# Altium schematic sheet power.SchDoc: sadasd
size A4
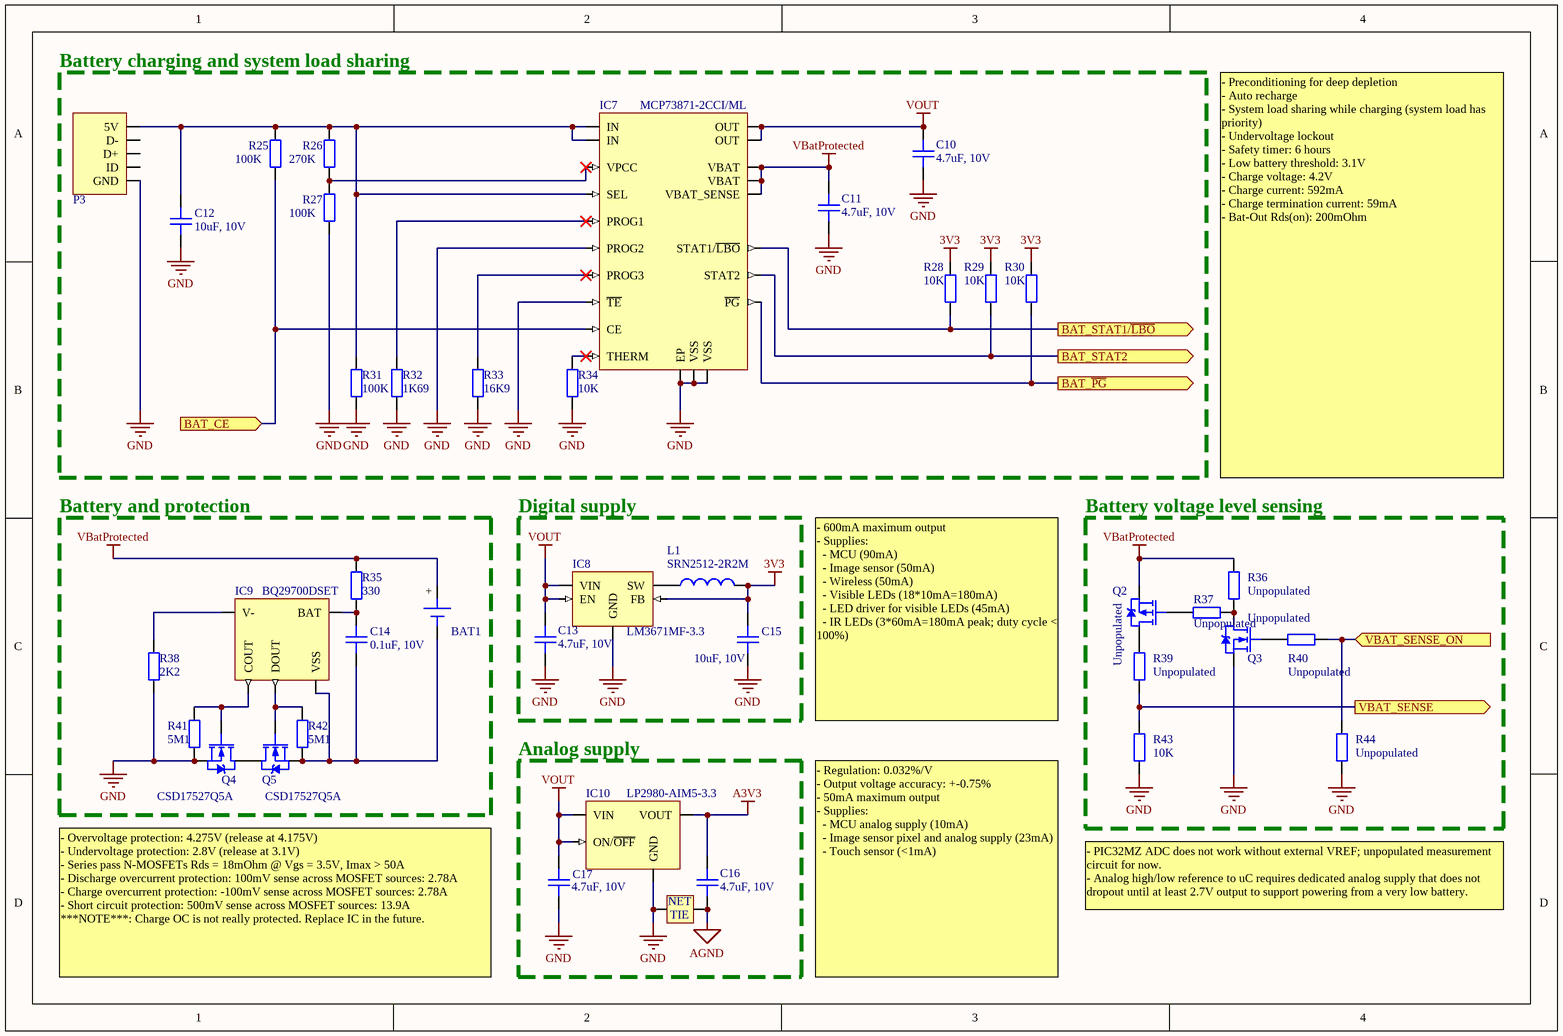
[diagram p0: power.SchDoc]

## Parts
BAT1  Battery_1S  [WAGO 2059-302]  (value not drawn)
C10  4.7uF, 10V  [1608[0603]_M]
C11  4.7uF, 10V  [1608[0603]_M]
C12  10uF, 10V  [1608[0603]_M]
C13  4.7uF, 10V  [1608[0603]_M]
C14  0.1uF, 10V  [1608[0603]_M]
C15  10uF, 10V  [1608[0603]_M]
C16  4.7uF, 10V  [1608[0603]_M]
C17  4.7uF, 10V  [1608[0603]_M]
IC7  MCP73871-2CCI/ML  [QFN-20_M]
IC8  LM3671MF-3.3  [SOT23-5_N]
IC9  BQ29700DSET  [WSON-6_M]
IC10  LP2980-AIM5-3.3  [SOT23-5_N]
L1  SRN2512-2R2M  [2520[1008]_N]
NT1  NET-TIE  [NET-TIE-0.15MM]  (value not drawn)  (net tie, no BOM)
P3  MicroUSB2.0  [USB3076_M]  (value not drawn)
Q2  Unpopulated  [SOT23-3_N]
Q3  Unpopulated  [SOT23-3_N]
Q4  CSD17527Q5A  [PG-TDSON-8_MOSFET_M]
Q5  CSD17527Q5A  [PG-TDSON-8_MOSFET_M]
R25  100K  [1608[0603]_M]
R26  270K  [1608[0603]_M]
R27  100K  [1608[0603]_M]
R28  10K  [1608[0603]_M]
R29  10K  [1608[0603]_M]
R30  10K  [1608[0603]_M]
R31  100K  [1608[0603]_M]
R32  1K69  [1608[0603]_M]
R33  16K9  [1608[0603]_M]
R34  10K  [1608[0603]_M]
R35  330  [1608[0603]_M]
R36  Unpopulated  [1608[0603]_M]
R37  Unpopulated  [1608[0603]_M]
R38  2K2  [1608[0603]_M]
R39  Unpopulated  [1608[0603]_M]
R40  Unpopulated  [1608[0603]_M]
R41  5M1  [1608[0603]_M]
R42  5M1  [1608[0603]_M]
R43  10K  [1608[0603]_M]
R44  Unpopulated  [1608[0603]_M]

## Blocks framed on the sheet
Battery charging and system load sharing: C10-C12 IC7 P3 R25-R34
Battery and protection: BAT1 C14 IC9 Q4 Q5 R35 R38 R41 R42
Digital supply: C13 C15 IC8 L1
Battery voltage level sensing: Q2 Q3 R36 R37 R39 R40 R43 R44
Analog supply: C16 C17 IC10 NT1

## Ports
BAT_CE (in), BAT_STAT1/~{LBO} (out), BAT_STAT2 (out), BAT_~{PG} (out), VBAT_SENSE (out), VBAT_SENSE_ON (in)

## Nets
3V3: C15.2 IC8.4(FB) L1.2 R28.2 R29.2 R30.2
A3V3: C16.2 IC10.5(VOUT)
AGND: C16.1 NT1.2
GND: C10.1 C11.1 C12.1 C13.1 C15.1 C17.1 IC7.4(PROG2) IC7.9(~{TE}) IC7.10(VSS) IC7.11(VSS) IC7.EP IC8.2(GND) IC10.2(GND) NT1.1 P3.5(GND) Q3.S Q4.S R27.1 R31.1 R32.1 R33.1 R34.1 R38.1 R41.1 R43.1 R44.1
VBatProtected: BAT1.+ C11.2 IC7.14(VBAT) IC7.15(VBAT) IC7.16(VBAT_SENSE) Q2.S R35.2 R36.2
VOUT: C10.2 C13.2 C17.2 IC7.1(OUT) IC7.20(OUT) IC8.1(VIN) IC8.3(EN) IC10.1(VIN) IC10.3(ON/~{OFF})
BAT_CE: IC7.17(CE) R25.1 ; port BAT_CE
BAT_~{PG}: IC7.6(~{PG}) R30.1 ; port BAT_~{PG}
BAT_STAT1/~{LBO}: IC7.8(STAT1/~{LBO}) R28.1 ; port BAT_STAT1/~{LBO}
BAT_STAT2: IC7.7(STAT2) R29.1 ; port BAT_STAT2
VBAT_SENSE: R39.1 R43.2 ; port VBAT_SENSE
VBAT_SENSE_ON: R40.2 R44.2 ; port VBAT_SENSE_ON
NetBAT1_-: BAT1.- C14.1 IC9.4(VSS) Q5.S R42.1
NetC12_2: C12.2 IC7.3(SEL) IC7.18(IN) IC7.19(IN) P3.1(5V) R25.2 R26.2 R31.2
NetC14_2: C14.2 IC9.5(BAT) R35.1
NetIC7_2: IC7.2(VPCC) R26.1 R27.2
NetIC7_5: IC7.5(THERM) R34.2
NetIC7_12: IC7.12(PROG3) R33.2
NetIC7_13: IC7.13(PROG1) R32.2
NetIC8_5: IC8.5(SW) L1.1
NetIC9_2: IC9.2(COUT) Q4.G R41.2
NetIC9_3: IC9.3(DOUT) Q5.G R42.2
NetIC9_6: IC9.6(V-) R38.2
NetQ2_D: Q2.D R39.2
NetQ2_G: Q2.G R37.1
NetQ3_D: Q3.D R36.1 R37.2
NetQ3_G: Q3.G R40.1
NetQ4_D: Q4.D Q5.D

Not connected (* = marked no-connect by the designer): P3 2(D-) 3(D+) 4(ID)

## Notes on the sheet
- - Preconditioning for deep depletion
  - Auto recharge
  - System load sharing while charging (system load has priority)
  - Undervoltage lockout
  - Safety timer: 6 hours
  - Low battery threshold: 3.1V
  - Charge voltage: 4.2V
  - Charge current: 592mA
  - Charge termination current: 59mA
  - Bat-Out Rds(on): 200mOhm
- - 600mA maximum output
  - Supplies:
  - MCU (90mA)
  - Image sensor (50mA)
  - Wireless (50mA)
  - Visible LEDs (18*10mA=180mA)
  - LED driver for visible LEDs (45mA)
  - IR LEDs (3*60mA=180mA peak; duty cycle < 100%)
- - PIC32MZ ADC does not work without external VREF; unpopulated measurement circuit for now.
  - Analog high/low reference to uC requires dedicated analog supply that does not dropout until at least 2.7V output to support powering from a very low battery.
- - Overvoltage protection: 4.275V (release at 4.175V)
  - Undervoltage protection: 2.8V (release at 3.1V)
  - Series pass N-MOSFETs Rds = 18mOhm @ Vgs = 3.5V, Imax > 50A
  - Discharge overcurrent protection: 100mV sense across MOSFET sources: 2.78A
  - Charge overcurrent protection: -100mV sense across MOSFET sources: 2.78A
  - Short circuit protection: 500mV sense across MOSFET sources: 13.9A
  ***NOTE***: Charge OC is not really protected. Replace IC in the future.
- - Regulation: 0.032%/V
  - Output voltage accuracy: +-0.75%
  - 50mA maximum output
  - Supplies:
  - MCU analog supply (10mA)
  - Image sensor pixel and analog supply (23mA)
  - Touch sensor (<1mA)
- (in symbol NET-TIE) NET; TIE

## Library data of the parts
BAT1 = Battery_1S: Generic single cell battery; pin to pad: +>1 ->2
C10-C17 = Capacitor: Generic Capacitor
  C10 C11 C13 C16 C17: Value: 4.7uF, 10V
  C12 C15: Value: 10uF, 10V
  C14: Value: 0.1uF, 10V
IC7 = MCP73871-2CCI/ML: Li-Po battery charge controller with system load sharing
IC8 = LM3671: 2MHz, 600mA step-down converter
IC9 = BQ29700: Li-Po battery voltage and current protection
IC10 = LP2980-N: 50 mA, ultra low drop-out voltage regulator
L1 = Inductor: Value: 2.2uH
NT1 = NET-TIE: Generic net tie
P3 = MicroUSB2.0: Micro USB 2.0 plug/receptacle, 5-Leads
Q2 = MOSFET-P_BodyDiode: P-channel MOSFET with body diode drawn; pin to pad: D>3 G>1 S>2
Q3 = MOSFET-N_BodyDiode: N-channel MOSFET with body diode drawn; pin to pad: D>3 G>1 S>2
Q4 Q5 = MOSFET-N_BodyDiode: N-channel MOSFET with body diode drawn
R25-R44 = Resistor: Generic Resistor
  R25 R27 R31: Value: 100K
  R26: Value: 270K
  R28-R30 R34 R43: Value: 10K
  R32: Value: 1K69
  R33: Value: 16K9
  R35: Value: 330
  R36 R37 R39 R40 R44: Value: Unpopulated
  R38: Value: 2K2
  R41 R42: Value: 5M1